# Altium schematic sheet PA_Receiver.SchDoc
size A3; SheetNumber: 1; SheetTotal: 1
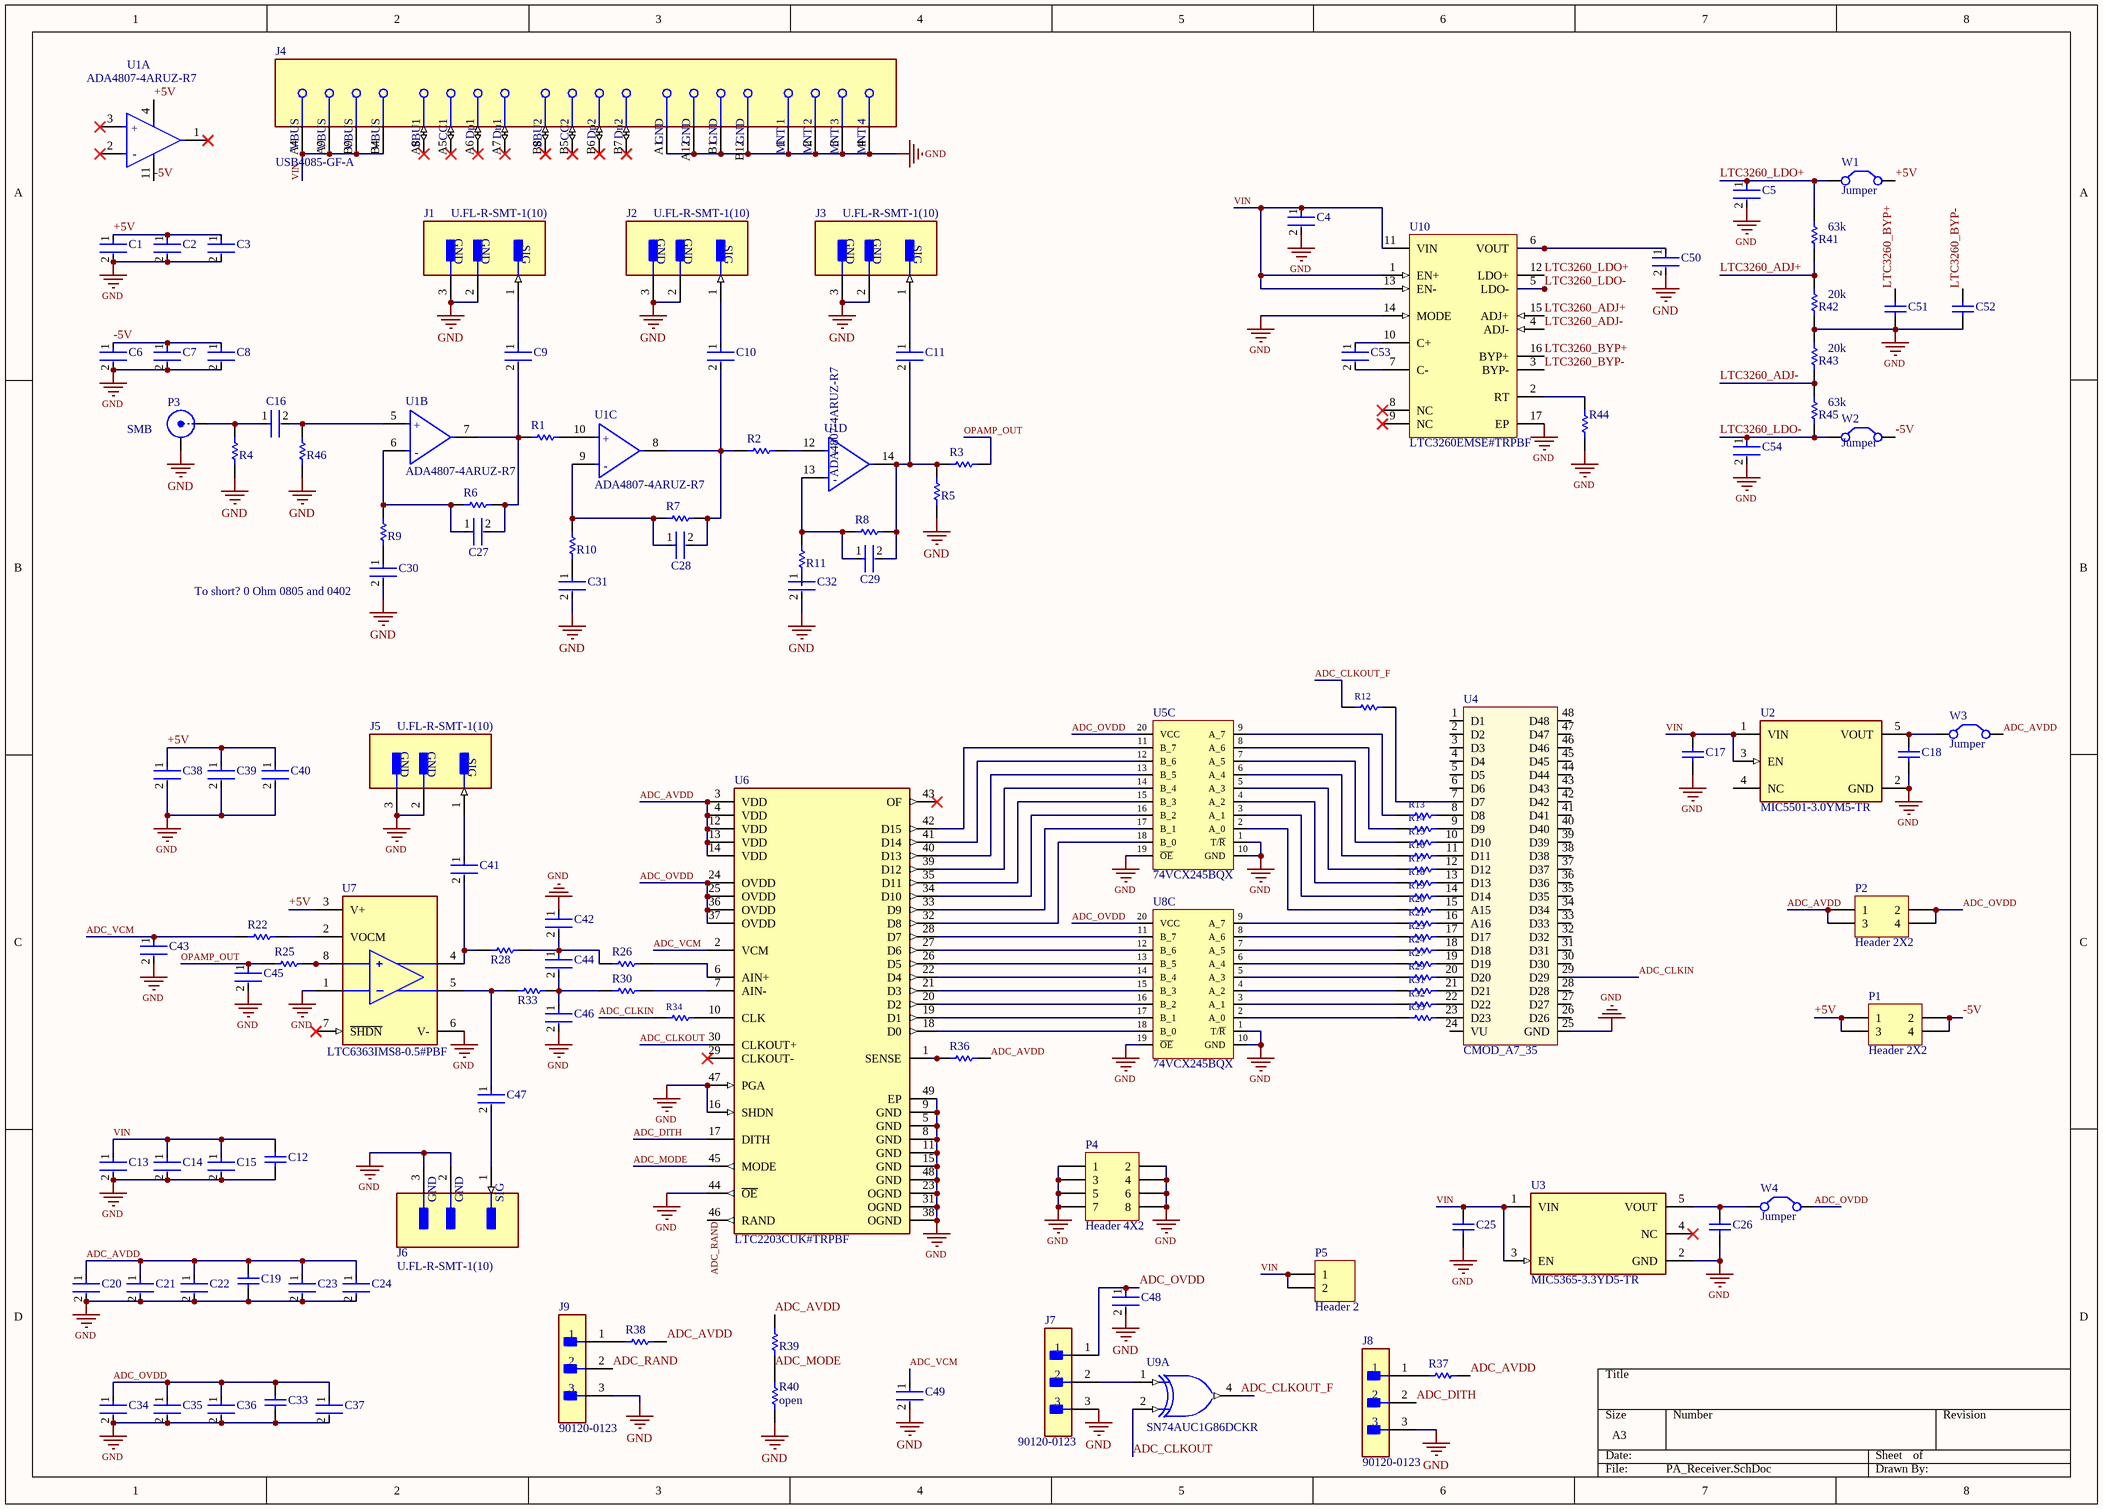
[diagram p0: PA_Receiver.SchDoc]

## Parts
C1  CL21B106KOQNNNG  [FP-CL21B106KOQNNNG-MFG]  (value not drawn)
C2  GRM21BR71C475KE51K  [FP-GRM21B-0_15-MFG]  (value not drawn)
C3  C0805C104K5RACTU  [FP-C0805C-DN-MFG]  (value not drawn)
C4  CL21B106KOQNNNG  [FP-CL21B106KOQNNNG-MFG]  (value not drawn)
C5  CL21B106KOQNNNG  [FP-CL21B106KOQNNNG-MFG]  (value not drawn)
C6  CL21B106KOQNNNG  [FP-CL21B106KOQNNNG-MFG]  (value not drawn)
C7  GRM21BR71C475KE51K  [FP-GRM21B-0_15-MFG]  (value not drawn)
C8  C0805C104K5RACTU  [FP-C0805C-DN-MFG]  (value not drawn)
C9  C0805C102K5RACTU  [FP-C0805C-DN-MFG]  (value not drawn)
C10  C0805C102K5RACTU  [FP-C0805C-DN-MFG]  (value not drawn)
C11  C0805C102K5RACTU  [FP-C0805C-DN-MFG]  (value not drawn)
C12  C0805C105K3RACTU  [CAPC2013X140X50LL20T25]  (value not drawn)
C13  CL21B106KOQNNNG  [FP-CL21B106KOQNNNG-MFG]  (value not drawn)
C14  GRM21BR71C475KE51K  [FP-GRM21B-0_15-MFG]  (value not drawn)
C15  C0805C104K5RACTU  [FP-C0805C-DN-MFG]  (value not drawn)
C16  CL21B222JBANNNC  [FP-CL21-IPC_B]  (value not drawn)
C17  C0805C105K3RACTU  [CAPC2013X140X50LL20T25]  (value not drawn)
C18  C0805C105K3RACTU  [CAPC2013X140X50LL20T25]  (value not drawn)
C19  C0805C105K3RACTU  [CAPC2013X140X50LL20T25]  (value not drawn)
C20  CL21B106KOQNNNG  [FP-CL21B106KOQNNNG-MFG]  (value not drawn)
C21  GRM21BR71C475KE51K  [FP-GRM21B-0_15-MFG]  (value not drawn)
C22  C0805C104K5RACTU  [FP-C0805C-DN-MFG]  (value not drawn)
C23  C0805C104K5RACTU  [FP-C0805C-DN-MFG]  (value not drawn)
C24  C0805C104K5RACTU  [FP-C0805C-DN-MFG]  (value not drawn)
C25  C0805C105K3RACTU  [CAPC2013X140X50LL20T25]  (value not drawn)
C26  C0805C105K3RACTU  [CAPC2013X140X50LL20T25]  (value not drawn)
C27  C0805C150K5RACTU  [FP-C0805C-DN-MFG]  (value not drawn)
C28  C0805C150K5RACTU  [FP-C0805C-DN-MFG]  (value not drawn)
C29  C0805C150K5RACTU  [FP-C0805C-DN-MFG]  (value not drawn)
C30  CL21B106KOQNNNG  [FP-CL21B106KOQNNNG-MFG]  (value not drawn)
C31  CL21B106KOQNNNG  [FP-CL21B106KOQNNNG-MFG]  (value not drawn)
C32  CL21B106KOQNNNG  [FP-CL21B106KOQNNNG-MFG]  (value not drawn)
C33  C0805C105K3RACTU  [CAPC2013X140X50LL20T25]  (value not drawn)
C34  CL21B106KOQNNNG  [FP-CL21B106KOQNNNG-MFG]  (value not drawn)
C35  GRM21BR71C475KE51K  [FP-GRM21B-0_15-MFG]  (value not drawn)
C36  C0805C104K5RACTU  [FP-C0805C-DN-MFG]  (value not drawn)
C37  C0805C104K5RACTU  [FP-C0805C-DN-MFG]  (value not drawn)
C38  CL21B106KOQNNNG  [FP-CL21B106KOQNNNG-MFG]  (value not drawn)
C39  GRM21BR71C475KE51K  [FP-GRM21B-0_15-MFG]  (value not drawn)
C40  C0805C104K5RACTU  [FP-C0805C-DN-MFG]  (value not drawn)
C41  C0805C102K5RACTU  [FP-C0805C-DN-MFG]  (value not drawn)
C42  C0805C100J5RACTU  [FP-C0805C-DN-MFG]  (value not drawn)
C43  C0805C104K5RACTU  [FP-C0805C-DN-MFG]  (value not drawn)
C44  C0805C100J5RACTU  [FP-C0805C-DN-MFG]  (value not drawn)
C45  C0805C100J5RACTU  [FP-C0805C-DN-MFG]  (value not drawn)
C46  C0805C100J5RACTU  [FP-C0805C-DN-MFG]  (value not drawn)
C47  C0805C102K5RACTU  [FP-C0805C-DN-MFG]  (value not drawn)
C48  C0805C104K5RACTU  [FP-C0805C-DN-MFG]  (value not drawn)
C49  C2012X7R1C225K125AB  [FP-C2012-125-0_2-MFG]  (value not drawn)
C50  CL21B106KOQNNNG  [FP-CL21B106KOQNNNG-MFG]  (value not drawn)
C51  C0805F103K5RACTU  [CAPC2013X100X50NL20T25]  (value not drawn)
C52  C0805F103K5RACTU  [CAPC2013X100X50NL20T25]  (value not drawn)
C53  CL21B105KAFNNNG  [FP-CL21-IPC_C]  (value not drawn)
C54  CL21B106KOQNNNG  [FP-CL21B106KOQNNNG-MFG]  (value not drawn)
J1  U.FL-R-SMT-1(10)  [FP-U_FL-R-SMT-1_10-MFG]
J2  U.FL-R-SMT-1(10)  [FP-U_FL-R-SMT-1_10-MFG]
J3  U.FL-R-SMT-1(10)  [FP-U_FL-R-SMT-1_10-MFG]
J4  USB4085-GF-A  [FP-USB4085-GF-A-MFG]
J5  U.FL-R-SMT-1(10)  [FP-U_FL-R-SMT-1_10-MFG]
J6  U.FL-R-SMT-1(10)  [FP-U_FL-R-SMT-1_10-MFG]
J7  90120-0123  [FP-90120-0123-MFG]
J8  90120-0123  [FP-90120-0123-MFG]
J9  90120-0123  [FP-90120-0123-MFG]
P1  Header 2X2  [HDR2X2]
P2  Header 2X2  [HDR2X2]
P3  SMB  [SMB_V-RJ45]
P4  Header 4X2  [HDR2X4]
P5  Header 2  [HDR1X2]
R1  RC0805FR-071KL  [RESC2013X60X35ML10T20]  (value not drawn)
R2  RC0805FR-071KL  [RESC2013X60X35ML10T20]  (value not drawn)
R3  ERJ-6GEY0R00V  [RESC2013X70X40NL20T20]  (value not drawn)
R4  RK73B2ATTD510J  [RESC2013X60X30ML20T20]  (value not drawn)
R5  RK73B2ATTD510J  [RESC2013X60X30ML20T20]  (value not drawn)
R6  RC0805FR-071KL  [RESC2013X60X35ML10T20]  (value not drawn)
R7  RC0805FR-071KL  [RESC2013X60X35ML10T20]  (value not drawn)
R8  RC0805FR-071KL  [RESC2013X60X35ML10T20]  (value not drawn)
R9  RC0805FR-07100RL  [RESC2013X60X35ML10T20]  (value not drawn)
R10  RC0805FR-07100RL  [RESC2013X60X35ML10T20]  (value not drawn)
R11  RC0805FR-07100RL  [RESC2013X60X35ML10T20]  (value not drawn)
R12  RC0805FR-0733RL  [RESC2013X60X35LL10T20]  (value not drawn)
R13  RC0805FR-0733RL  [RESC2013X60X35LL10T20]  (value not drawn)
R14  RC0805FR-0733RL  [RESC2013X60X35LL10T20]  (value not drawn)
R15  RC0805FR-0733RL  [RESC2013X60X35LL10T20]  (value not drawn)
R16  RC0805FR-0733RL  [RESC2013X60X35LL10T20]  (value not drawn)
R17  RC0805FR-0733RL  [RESC2013X60X35LL10T20]  (value not drawn)
R18  RC0805FR-0733RL  [RESC2013X60X35LL10T20]  (value not drawn)
R19  RC0805FR-0733RL  [RESC2013X60X35LL10T20]  (value not drawn)
R20  RC0805FR-0733RL  [RESC2013X60X35LL10T20]  (value not drawn)
R21  RC0805FR-0733RL  [RESC2013X60X35LL10T20]  (value not drawn)
R22  RC0805FR-07100RL  [RESC2013X60X35ML10T20]  (value not drawn)
R23  RC0805FR-0733RL  [RESC2013X60X35LL10T20]  (value not drawn)
R24  RC0805FR-0733RL  [RESC2013X60X35LL10T20]  (value not drawn)
R25  ERJ-6GEY0R00V  [RESC2013X70X40NL20T20]  (value not drawn)
R26  RC0805JR-075R1L  [RESC2013X60X35LL10T20]  (value not drawn)
R27  RC0805FR-0733RL  [RESC2013X60X35LL10T20]  (value not drawn)
R28  RK73B2ATTD510J  [RESC2013X60X30ML20T20]  (value not drawn)
R29  RC0805FR-0733RL  [RESC2013X60X35LL10T20]  (value not drawn)
R30  RC0805JR-075R1L  [RESC2013X60X35LL10T20]  (value not drawn)
R31  RC0805FR-0733RL  [RESC2013X60X35LL10T20]  (value not drawn)
R32  RC0805FR-0733RL  [RESC2013X60X35LL10T20]  (value not drawn)
R33  RK73B2ATTD510J  [RESC2013X60X30ML20T20]  (value not drawn)
R34  RC0805FR-0733RL  [RESC2013X60X35LL10T20]  (value not drawn)
R35  RC0805FR-0733RL  [RESC2013X60X35LL10T20]  (value not drawn)
R36  RK73H2ATTD10R0F  [RESC2013X60X30ML20T20]  (value not drawn)
R37  RK73H2ATTD1002F  [RESC2013X60X30LL20T20]  (value not drawn)
R38  RK73H2ATTD1002F  [RESC2013X60X30LL20T20]  (value not drawn)
R39  RC0805FR-071KL  [RESC2013X60X35ML10T20]  (value not drawn)
R40  value open  [RESC2013X60X35LL10T20]  (hidden comment: Resistor)
R41  63k  [RESC2013X60X30ML20T20]
R42  20k  [RESC2013X60X30ML20T20]
R43  20k  [RESC2013X60X30ML20T20]
R44  CRCW0805200KFKEA  [RESC2013X50X30NL20T20]  (value not drawn)
R45  63k  [RESC2013X60X30ML20T20]
R46  RK73B2ATTD510J  [RESC2013X60X30ML20T20]  (value not drawn)
U1  ADA4807-4ARUZ-R7  [FP-RU-14-IPC_B]  (parts A,B,C,D of 4)
U2  MIC5501-3.0YM5-TR  [FP-SOT23-5LD-PL-1-MFG]
U3  MIC5365-3.3YD5-TR  [FP-TSOT-5LD-PL-1-IPC_C]
U4  CMOD_A7_35  [PCBComponent_1]
U5  74VCX245BQX  [QFN21P50_450X250X80L40X24T305X105N]  (part C of 3)
U6  LTC2203CUK#TRPBF  [FP-UK-48-05-08-1704-IPC_C]
U7  LTC6363IMS8-0.5#PBF  [FP-MS8-8-05-08-1660-IPC_A]
U8  74VCX245BQX  [QFN21P50_450X250X80L40X24T305X105N]  (part C of 3)
U9  SN74AUC1G86DCKR  [DCK0005A_N]  (part A of 2)
U10  LTC3260EMSE#TRPBF  [LT-MSE-16-EDP_L]
W1  Jumper  [FP-M20-9990246-MFG]
W2  Jumper  [FP-M20-9990246-MFG]
W3  Jumper  [FP-M20-9990246-MFG]
W4  Jumper  [FP-M20-9990246-MFG]

## Nets
GND: C1.2 C2.2 C3.2 C4.2 C5.2 C6.2 C7.2 C8.2 C12.1 C13.2 C14.2 C15.2 C17.1 C18.1 C19.1 C20.2 C21.2 C22.2 C23.2 C24.2 C25.1 C26.1 C30.2 C31.2 C32.2 C33.1 C34.2 C35.2 C36.2 C37.2 C38.2 C39.2 C40.2 C42.1 C43.2 C45.2 C46.2 C48.2 C49.2 C50.2 C51.1 C52.1 C54.2 J1.2(GND) J1.3(GND) J2.2(GND) J2.3(GND) J3.2(GND) J3.3(GND) J4.1(MNT_1) J4.2(MNT_2) J4.3(MNT_3) J4.4(MNT_4) J4.A1(GND) J4.A12(GND) J4.B1(GND) J4.B12(GND) J5.2(GND) J5.3(GND) J6.2(GND) J6.3(GND) J7.3 J8.3 J9.3 P3.2(Y) P4.1 P4.2 P4.3 P4.4 P4.5 P4.6 P4.7 P4.8 R4.1 R5.1 R40.1 R42.1 R43.2 R44.1 R46.1 U2.2(GND) U3.2(GND) U4.25(GND) U5.1(T/~{R}) U5.10(GND) U5.19(~{OE}) U6.5(GND) U6.8(GND) U6.9(GND) U6.11(GND) U6.15(GND) U6.16(SHDN) U6.23(OGND) U6.31(OGND) U6.38(OGND) U6.44(~{OE}) U6.47(PGA) U6.48(GND) U6.49(EP) U7.1(-IN) U7.6(V-) U8.1(T/~{R}) U8.10(GND) U8.19(~{OE}) U10.14(MODE) U10.17(EP)
+5V: C1.1 C2.1 C3.1 C38.1 C39.1 C40.1 P1.1 P1.3 U1.4(+VS) U7.3(V+) W1.2(C2)
-5V: C6.1 C7.1 C8.1 P1.2 P1.4 U1.11(-VS) W2.2(C2)
ADC_AVDD: C19.2 C20.1 C21.1 C22.1 C23.1 C24.1 P2.1 P2.3 R36.2 R37.2 R38.2 R39.2 U6.3(VDD) U6.4(VDD) U6.12(VDD) U6.13(VDD) U6.14(VDD) W3.2(C2)
ADC_CLKIN: R34.1 U4.29(D29)
ADC_CLKOUT: U6.30(CLKOUT+) U9.2(B)
ADC_CLKOUT_F: R12.1 U9.4(Y)
ADC_DITH: J8.2 U6.17(DITH)
ADC_MODE: R39.1 R40.2 U6.45(MODE)
ADC_OVDD: C33.2 C34.1 C35.1 C36.1 C37.1 C48.1 J7.1 P2.2 P2.4 U5.20(VCC) U6.24(OVDD) U6.25(OVDD) U6.36(OVDD) U6.37(OVDD) U8.20(VCC) W4.2(C2)
ADC_RAND: J9.2 U6.46(RAND)
ADC_VCM: C43.1 C49.1 R22.1 U6.2(VCM)
LTC3260_ADJ+: R41.1 R42.2 U10.15(ADJ+)
LTC3260_ADJ-: R43.1 R45.2 U10.4(ADJ-)
LTC3260_BYP+: C51.2 U10.16(BYP+)
LTC3260_BYP-: C52.2 U10.3(BYP-)
LTC3260_LDO+: C5.1 R41.2 U10.12(LDO+) W1.1(C1)
LTC3260_LDO-: C54.1 R45.1 U10.5(LDO-) W2.1(C1)
OPAMP_OUT: C45.1 R3.2 R25.1
VIN: C4.1 C12.2 C13.1 C14.1 C15.1 C17.2 C25.2 J4.A4(VBUS) J4.A9(VBUS) J4.B4(VBUS) J4.B9(VBUS) P5.1 P5.2 U2.1(VIN) U2.3(EN) U3.1(VIN) U3.3(EN) U10.1(EN+) U10.11(VIN) U10.13(EN-)
NetC9_1: C9.1 J1.1(SIG)
NetC9_2: C9.2 C27.2 R1.1 R6.2 U1.7(VOUT2)
NetC10_1: C10.1 J2.1(SIG)
NetC10_2: C10.2 C28.2 R2.1 R7.2 U1.8(VOUT3)
NetC11_1: C11.1 J3.1(SIG)
NetC11_2: C11.2 C29.2 R3.1 R5.2 R8.2 U1.14(VOUT4)
NetC16_1: C16.1 P3.1(X) R4.2
NetC16_2: C16.2 R46.2 U1.5(+IN2)
NetC18_2: C18.2 U2.5(VOUT) W3.1(C1)
NetC26_2: C26.2 U3.5(VOUT) W4.1(C1)
NetC27_1: C27.1 R6.1 R9.1 U1.6(-IN2)
NetC28_1: C28.1 R7.1 R10.1 U1.9(-IN3)
NetC29_1: C29.1 R8.1 R11.1 U1.13(-IN4)
NetC30_1: C30.1 R9.2
NetC31_1: C31.1 R10.2
NetC32_1: C32.1 R11.2
NetC41_1: C41.1 J5.1(SIG)
NetC41_2: C41.2 R28.2 U7.4(+OUT)
NetC42_2: C42.2 C44.1 R26.1 R28.1
NetC44_2: C44.2 C46.1 R30.1 R33.1
NetC47_1: C47.1 R33.2 U7.5(-OUT)
NetC47_2: C47.2 J6.1(SIG)
NetC50_1: C50.1 U10.6(VOUT)
NetC53_1: C53.1 U10.10(C+)
NetC53_2: C53.2 U10.7(C-)
NetJ7_2: J7.2 U9.1(A)
NetJ8_1: J8.1 R37.1
NetJ9_1: J9.1 R38.1
NetR1_2: R1.2 U1.10(+IN3)
NetR2_2: R2.2 U1.12(+IN4)
NetR12_2: R12.2 U4.7(D7)
NetR13_1: R13.1 U5.9(A_7)
NetR13_2: R13.2 U4.8(D8)
NetR14_1: R14.1 U5.8(A_6)
NetR14_2: R14.2 U4.9(D9)
NetR15_1: R15.1 U5.7(A_5)
NetR15_2: R15.2 U4.10(D10)
NetR16_1: R16.1 U5.6(A_4)
NetR16_2: R16.2 U4.11(D11)
NetR17_1: R17.1 U5.5(A_3)
NetR17_2: R17.2 U4.12(D12)
NetR18_1: R18.1 U5.4(A_2)
NetR18_2: R18.2 U4.13(D13)
NetR19_1: R19.1 U5.3(A_1)
NetR19_2: R19.2 U4.14(D14)
NetR20_1: R20.1 U5.2(A_0)
NetR20_2: R20.2 U4.15(A15)
NetR21_1: R21.1 U8.9(A_7)
NetR21_2: R21.2 U4.16(A16)
NetR22_2: R22.2 U7.2(VOCM)
NetR23_1: R23.1 U8.8(A_6)
NetR23_2: R23.2 U4.17(D17)
NetR24_1: R24.1 U8.7(A_5)
NetR24_2: R24.2 U4.18(D18)
NetR25_2: R25.2 U7.8(+IN)
NetR26_2: R26.2 U6.6(AIN+)
NetR27_1: R27.1 U8.6(A_4)
NetR27_2: R27.2 U4.19(D19)
NetR29_1: R29.1 U8.5(A_3)
NetR29_2: R29.2 U4.20(D20)
NetR30_2: R30.2 U6.7(AIN-)
NetR31_1: R31.1 U8.4(A_2)
NetR31_2: R31.2 U4.21(D21)
NetR32_1: R32.1 U8.3(A_1)
NetR32_2: R32.2 U4.22(D22)
NetR34_2: R34.2 U6.10(CLK)
NetR35_1: R35.1 U8.2(A_0)
NetR35_2: R35.2 U4.23(D23)
NetR36_1: R36.1 U6.1(SENSE)
NetR44_2: R44.2 U10.2(RT)
NetU5_11: U5.11(B_7) U6.42(D15)
NetU5_12: U5.12(B_6) U6.41(D14)
NetU5_13: U5.13(B_5) U6.40(D13)
NetU5_14: U5.14(B_4) U6.39(D12)
NetU5_15: U5.15(B_3) U6.35(D11)
NetU5_16: U5.16(B_2) U6.34(D10)
NetU5_17: U5.17(B_1) U6.33(D9)
NetU5_18: U5.18(B_0) U6.32(D8)
NetU6_18: U6.18(D0) U8.18(B_0)
NetU6_19: U6.19(D1) U8.17(B_1)
NetU6_20: U6.20(D2) U8.16(B_2)
NetU6_21: U6.21(D3) U8.15(B_3)
NetU6_22: U6.22(D4) U8.14(B_4)
NetU6_26: U6.26(D5) U8.13(B_5)
NetU6_27: U6.27(D6) U8.12(B_6)
NetU6_28: U6.28(D7) U8.11(B_7)

Not connected (* = marked no-connect by the designer): J4 A5(CC1)* A6(Dp1)* A7(Dn1)* A8(SBU1)* B5(CC2)* B6(Dp2)* B7(Dn2)* B8(SBU2)*; U1 1(VOUT1)* 2(-IN1)* 3(+IN1)*; U2 4(NC); U3 4(NC)*; U4 1(D1) 2(D2) 3(D3) 4(D4) 5(D5) 6(D6) 24(VU) 26(D26) 27(D27) 28(D28) 30(D30) 31(D31) 32(D32) 33(D33) 34(D34) 35(D35) 36(D36) 37(D37) 38(D38) 39(D39) 40(D40) 41(D41) 42(D42) 43(D43) 44(D44) 45(D45) 46(D46) 47(D47) 48(D48); U6 29(CLKOUT-)* 43(OF)*; U7 7(~{SHDN})*; U10 8(NC)* 9(NC)*

## Notes on the sheet
- (near C30) To short? 0 Ohm 0805 and 0402
- (in symbol CMP-09116-000192-1, part A) +; -
- (in symbol CMP-09116-000192-1, part B) +; -
- (in symbol CMP-09116-000192-1, part C) +; -
- (in symbol CMP-09116-000192-1, part D) +; -

## Library data of the parts
C1 C4-C6 C13 C20 C30-C32 C34 C38 C50 C54 = CMP-13271-000015-1: CAP CER 10UF 16V X7R 0805; Manufacturer: Samsung Electro-Mechanics; Temperature Coefficient: 15%; Tolerance: 10%; Material: Ceramic; ComponentLink2URL: http://product.samsungsem.com/mlcc/CL21B106KOQNNN.do; Package: 0; Voltage Rating: 16V; Value: 10uF; Height: 1.4mm; Temperature Characteristic: X7R; Manufacturer Part Number: CL21B106KOQNNNG; Category: Cap; Lead Free: Yes; RoHS: TRUE; ComponentLink2Description: Datasheet; Octopart: https://octopart.com/cl21b106koqnnng-samsung-19995691; Device Class L1: Passive Components; Temperature Range Low: -55°C; Device Class L3: Ceramic Capacitors; Ipc Land Pattern Name: CAPC200125X125; Digikey Description: CAP CER 10UF 16V X7R 0805; Automotive: No; Capacitance: 10uF; Temperature Range High: +125°C; Device Class L2: Capacitors; Temperature: -55°C to +125°C
C2 C7 C14 C21 C35 C39 = CMP-06035-031349-1: Chip Multilayer Ceramic Capacitors for General Purpose, 0805, 4.7uF, X7R, 15%, 10%, 16V; Dielectric: X7R; Length: 2mm; Tolerance: 10%; Capacitance: 4.7uF; Voltage Rating (DC): 16V; Width: 1.25mm; Thickness: 1.25mm; Case/Package: 0805
C3 C8 C15 C22-C24 C36 C37 C40 C43 C48 = CMP-2007-00279-2: CAP CER 0.1UF 50V X7R 0805; Manufacturer: KEMET; Value: 0.10 μF; Tolerance: 0.1; Temperature Coefficient: 30ppm/°C; Material: Ceramic; Manufacturer Part Number: C0805C104K5RACTU; Device Class L2: Capacitors; Temperature Range Low: -55°C; Voltage Rating: 50 V; Digikey Description: CAP CER 0.1UF 50V X7R 0805; Category: Cap; ComponentLink2Description: Datasheet; Octopart: https://octopart.com/c0805c104k5ractu-kemet-143926; RoHS: TRUE; ComponentLink2URL: https://content.kemet.com/datasheets/KEM_C1003_C0G_SMD.pdf; Temperature Characteristic: X7R; Temperature: -55°C to +125°C; Height: 0.88mm; Temperature Range High: +125°C; Device Class L1: Passive Components; Automotive: No; Lead Free: Yes; Ipc Land Pattern Name: CAPC200125X78; Device Class L3: Ceramic Capacitors; Mouser Description: Cap Ceramic 0.1uF 50V X7R 10% SMD 2.0 x 1.2 mm 125 C Paper T/R; Capacitance: 0.10 μF; Package: C0805C-DN
C9-C11 C41 C47 = CMP-2007-01097-2: CAP CER 1000PF 50V X7R 0805; Manufacturer: KEMET; Capacitance: 1,000 pF; Value: 1,000 pF; Tolerance: 0.1; Temperature Coefficient: 30ppm/°C; Material: Ceramic; Temperature Range High: +125°C; Automotive: No; Device Class L3: Ceramic Capacitors; Category: Cap; Height: 0.88mm; Ipc Land Pattern Name: CAPC200125X78; Mouser Description: Cap Ceramic 0.001uF 50V X7R 10% SMD 0805 125C Plastic T/R; Device Class L1: Passive Components; Lead Free: Yes; Temperature Range Low: -55°C; ComponentLink2URL: https://content.kemet.com/datasheets/KEM_C1003_C0G_SMD.pdf; Octopart: https://octopart.com/c0805c102k5ractu-kemet-93010; Temperature: -55°C to +125°C; Package: C0805C-DN; RoHS: TRUE; Voltage Rating: 50 V; ComponentLink2Description: Datasheet; Digikey Description: CAP CER 1000PF 50V X7R 0805; Device Class L2: Capacitors; Manufacturer Part Number: C0805C102K5RACTU; Temperature Characteristic: X7R
C12 C17-C19 C25 C26 C33 = CMP-2007-03234-1: Manufacturer: Kemet; Part Number: C0805C105K3RACTU
C16 = CMP-13271-000077-1: CL21 Series 0805 2.2nF 50V ±5% Tolerance X7R Multilayer Ceramic Chip Capacitor; Voltage Rating: 50V; Case/Package: 0805; Voltage Rating (DC): 50V; Dielectric: X7R; Lead Free: Lead Free; Max Operating Temperature: 125°C; Width: 0.049inch; Case Code (Imperial): 0805; Case Code (Metric): 2012; Tolerance: 5%; Length: 2mm; Mount: Surface Mount; Contact Plating: Tin; Voltage: 50V; Height: 0.65mm; Package Quantity: 4000; Thickness: 0.03inch; Depth: 1.25mm; Min Operating Temperature: -55°C; Radiation Hardening: No; Capacitance: 2.2nF; Packaging: Tape and Reel
C27-C29 = CMP-03020-023493-1: CAP CER SMD 0805 15PF 50V 10% X7; Manufacturer: KEMET; Temperature Characteristic: X7R; Tolerance: 0.1; Material: Ceramic; Temperature Coefficient: 30ppm/°C; Octopart: https://octopart.com/c0805c150k5ractu-kemet-88373275; ComponentLink2URL: https://content.kemet.com/datasheets/KEM_C1003_C0G_SMD.pdf; Manufacturer Part Number: C0805C150K5RACTU; Device Class L3: Ceramic Capacitors; Lead Free: Yes; Digikey Description: CAP CER SMD 0805 15PF 50V 10% X7; Value: 15 pF; Mouser Description: Cap Ceramic 15pF 50V X7R 10% SMD 0805 125°C Paper T/R; Automotive: No; Voltage Rating: 50 V; Ipc Land Pattern Name: CAPC200125X78; Height: 0.88mm; Device Class L2: Capacitors; Capacitance: 15 pF; Temperature: -55°C to +125°C; Category: Cap; RoHS: TRUE; Temperature Range High: +125°C; Temperature Range Low: -55°C; Device Class L1: Passive Components; Package: C0805C-DN; ComponentLink2Description: Datasheet
C42 C44-C46 = CMP-03020-021676-1: C0805 10 pF X7R 30ppm/°C 5.00% 50 V; Manufacturer: KEMET; Material: Ceramic; Value: 10 pF; Voltage Rating: 50 V; Tolerance: 0.05; ComponentLink2URL: https://content.kemet.com/datasheets/KEM_C1003_C0G_SMD.pdf; Device Class L2: Capacitors; Octopart: https://octopart.com/c0805c100j5ractu-kemet-81794931; Height: 0.88mm; Ipc Land Pattern Name: CAPC200125X78; ComponentLink2Description: Datasheet; Temperature Range Low: -55°C; Automotive: No; Category: Cap; Device Class L3: Ceramic Capacitors; Device Class L1: Passive Components; Capacitance: 10 pF; Manufacturer Part Number: C0805C100J5RACTU; Temperature Coefficient: 30ppm/°C; Temperature Range High: +125°C; Lead Free: Yes; Package: C0805C-DN; Temperature: -55°C to +125°C; Mouser Description: Cap, 10PF, 50V, Mlcc, 0805; RoHS: TRUE; Temperature Characteristic: X7R
C49 = CMP-08246-006241-1: Multilayer Ceramic Capacitors 2.2μF ±10% 16V X7R SMD 0805; Capacitance: 2.2uF; Radiation Hardening: No; Series: C; REACH SVHC: No SVHC; Max Operating Temperature: 125°C; Case Code (Metric): 2012; Construction: Flat; Lead Free: Lead Free; Number of Pins: 2; Voltage Rating: 16V; Min Operating Temperature: -55°C; Voltage Rating (DC): 16V; Package Quantity: 2000; Thickness: 0.057inch; Case Code (Imperial): 0805; RoHS Compliant: Yes; Length: 2mm; Depth: 1.25mm; Packaging: Tape and Reel; Tolerance: 10%; Mount: Surface Mount; Dielectric: X7R; Width: 1.25mm; Case/Package: 0805; Weight: 0.000194oz; Dielectric Material: Ceramic; Termination: SMD/SMT; Voltage: 16V; Resistor Type: Ceramic; Height: 1.25mm
C51 C52 = CMP-2007-03708-1: Manufacturer: Kemet; Part Number: C0805F103K5RACTU
C53 = CMP-13271-003813-1: CL21 Series 0805 1uF 25V ±10% Tolerance X7R Multilayer Ceramic Chip Capacitor; Case Code (Imperial): 0805; Length: 2mm; Max Operating Temperature: 125°C; Tolerance: 10%; Depth: 1.25mm; Package Quantity: 3000; Material: Ceramic; Voltage Rating: 25V; Capacitance: 1uF; Height: 1.25mm; Mount: Surface Mount; Dielectric: X7R; Packaging: Tape and Reel; Voltage: 25V; Case/Package: 0805; Radiation Hardening: No; Thickness: 0.053inch; Width: 0.049inch; Min Operating Temperature: -55°C; Case Code (Metric): 2012
J1-J3 J5 J6 = CMP-2000-05152-3: CONN U.FL RCPT STR 50 OHM SMD; Max Frequency: 6GHz; Connector Type: Coaxial; Body Plating: Silver; Body Material: Bronze; Impedance: 50R; Dielectric Material: Polymer; Insulation Resistance: 500MR; Gender: Male; Packaging: Cut Tape; Length: 3mm; Package Quantity: 2500; Termination: Solder; Lead Free: Lead Free; Series: U.FL; Min Operating Temperature: -40°C; Fastening Type: Snap; Contact Material: Brass; Orientation: Straight; Wire/Cable Type: Coaxial; Frequency: 6GHz; Contact Plating: Gold; Depth: 3.1mm; Weight: 0.001764oz; Max Operating Temperature: 90°C; Radiation Hardening: No; REACH SVHC: No SVHC; Mount: Surface Mount; Housing Color: Beige
J4 = CMP-196119-000001-2: CONN RCPT USB2.0 TYPE C 24POS RA; Gender: Receptacle; Number of Positions: 16; USB Standard: USB 2.0; Orientation: Right Angle; Contact Plating: Gold; Contact Material: Copper Alloy
J7-J9 = CMP-04776-000237-1: CONN HEADER VERT 3POS 2.54MM; Number of Circuits: 3; Max Voltage Rating (DC): 350.35kV; Contact Resistance: 20mR; Gender: Male; Voltage Rating (AC): 350V; Glow Wire Compliant: Non-compliant; Current Rating: 3A; Contact Post Length: 2.9mm; Number of Contacts: 3; Number of Rows: 1; Max Operating Temperature: 125°C; Orientation: Vertical; Number of Positions: 3; Packaging: Tray; Contact Mating Length: 6.75mm; Housing Color: Black; Termination: Solder; Contact Material: Brass; Radiation Hardening: No; Lead Free: Lead Free; Pitch: 2.54mm; RoHS Compliant: Yes; Voltage Rating: 350V; Contact Plating: Tin; Color: Black; Min Operating Temperature: -55°C; Mount: Through Hole; Housing Material: Polyester; Series: 90120; Contact Gender: Male; REACH SVHC: No SVHC
P1 P2 = Header 2X2: Header, 2-Pin, Dual row; LatestRevisionDate: 17-Jul-2002; LatestRevisionNote: Re-released for DXP Platform.; Publisher: Altium Limited
P3 = SMB: SMB Straight Connector; LatestRevisionDate: 17-Jul-2002; LatestRevisionNote: Re-released for DXP Platform.; Publisher: Altium Limited
P4 = Header 4X2: Header, 4-Pin, Dual row; LatestRevisionDate: 17-Jul-2002; LatestRevisionNote: Re-released for DXP Platform.; Publisher: Altium Limited
P5 = Header 2: Header, 2-Pin; LatestRevisionDate: 17-Jul-2002; LatestRevisionNote: Re-released for DXP Platform.; Publisher: Altium Limited
R1 R2 R6-R8 R39 = CMP-2100-03671-1: Chip Resistor, 1 KOhm, +/- 1%, 125 mW, -55 to 155 degC, 0805 (2012 Metric), RoHS, Tape and Reel; Manufacturer: Yageo; Temperature Coefficient: 100ppm/degreesC; Voltage Rating (DC): 150V; Max Power Dissipation: 125mW; Resistance: 1KOhm; Number of Pins: 2; Number of Terminations: 2; Datasheet URL: http://www.yageo.com/NewPortal/yageodocoutput?fileName=/pdf/R-Chip/PYu-RC_Group_51_RoHS_L_5.pdf; Length: 0.079inch; Package Description: 2-Pin Surface Mounted Device, Body 2 x 1.25 mm; Depth: 1.25mm; Height: 0.024inch; Military Standard: Not; Case/Package: 0805; Package Reference: 0805; RoHSCompliant: true; Lead Free: LeadFree; Packaging: TapeandReel; Package Quantity: 1; Datasheet Version: Rev. 5, 10/2016; Tolerance: 1%; Min Operating Temperature: -55degC; Voltage Rating: 150V; Composition: ThickFilm; Case Code (Imperial): 0805; Power Rating: 125mW; Width: 0.049inch; Case Code (Metric): 2012; Manufacturer URL: http://www.yageo.com/; Max Operating Temperature: 155degC; REACH SVHC: Unknown; Termination: SMD/SMT
R3 R25 = CMP-1665-00002-5: Chip Resistor, 0 Ohm, +/- 1%, 0.125 W, -55 to 155 degC, 0805 (2012 Metric), RoHS, Tape and Reel; Tolerance: 5%; Resistance: 0 Ohm; REACH SVHC: No SVHC; Min Operating Temperature: -55 degC; Case/Package: 0805; Packaging: Tape and Reel; Package Quantity: 5000; ComponentLink1Description: Manufacturer URL; PackageDescription: 2-Pin Surface Mount Device, Body 2 x 1.25 mm; Mounting Technology: Surface Mount; Max Operating Temperature: 155 degC; PartNumber: ERJ-6GEY0R00V; Width: 1.25 mm; RoHSCompliant: True; Height: 0.6 mm; ComponentLink1URL: http://www.panasonic.com/; ComponentLink2URL: http://industrial.panasonic.com/cdbs/www-data/pdf/RDA0000/AOA0000C84.pdf; Case Code (Imperial): 0805; DatasheetVersion: 03/2015; Length: 2 mm; Case Code (Metric): 2012; ComponentLink2Description: Datasheet; Radiation Hardening: No
R4 R5 R28 R33 R46 = CMP-2001-01840-1: Manufacturer: KOA Speer; Part Number: RK73B2ATTD510J
R9-R11 R22 = CMP-2100-03669-1: Chip Resistor, 100 Ohm, +/-1%, 0.125 W, -55 to 155 degC, 0805 (2012 Metric), RoHS, Tape and Reel; Manufacturer: Yageo; Power Rating: 125mW; Resistance: 100Ohm; Voltage Rating: 150V; Tolerance: 1%; Temperature Coefficient: 100ppm/degreesC; Length: 2mm; Package Description: 2-Pin Surface Mounted Device, Body 2 x 1.25 mm; Case Code (Imperial): 0805; Number of Pins: 2; Termination: SMD/SMT; Lead Pitch: 0.4mm; Package Quantity: 1; Height: 0.024inch; Case Code (Metric): 2012; Number of Terminations: 2; Datasheet Version: Rev. 5, 10/2016; Lead Free: LeadFree; Package Reference: 0805; Composition: ThickFilm; REACH SVHC: Unknown; Voltage Rating (DC): 150V; Min Operating Temperature: -55degC; Packaging: TapeandReel; Military Standard: Not; Case/Package: 0805; Datasheet URL: http://www.yageo.com/NewPortal/yageodocoutput?fileName=/pdf/R-Chip/PYu-RC_Group_51_RoHS_L_5.pdf; Max Operating Temperature: 155degC; Manufacturer URL: http://www.yageo.com/; Max Power Dissipation: 125mW; Width: 0.049inch; Depth: 1.25mm; RoHSCompliant: true
R12-R21 R23 R24 R27 R29 R31 R32 R34 R35 = CMP-1659-00015-4: Chip Resistor, 33 Ohm, +/- 1%, 0.125 W, -55 to 155 degC, 0805 (2012 Metric), RoHS, Tape and Reel; Manufacturer: Yageo; Voltage Rating: 150 V; Max Operating Temperature: 155 degC; DatasheetVersion: Rev. 4, 02/2016; RoHSCompliant: true; ComponentLink2Description: Datasheet; PackageDescription: 2-Pin Surface Mounted Device, Body 2 x 1.25 mm; Package Quantity: 5000; Packaging: Tape and Reel; Min Operating Temperature: -55 degC; Mount: Surface Mount; REACH SVHC: No SVHC; ComponentLink1Description: Manufacturer URL; ComponentLink1URL: http://www.yageo.com/; Pins: 2; Mounting Technology: Surface Mount; Height: 0.5 mm; ComponentLink2URL: http://www.yageo.com/documents/recent/PYu-RC_Group_51_RoHS_L_04.pdf; PackageReference: 0805; Length: 2 mm
R26 R30 = CMP-2001-01391-1: Manufacturer: Yageo; Part Number: RC0805JR-075R1L
R36 = CMP-2001-02011-1: Manufacturer: KOA Speer; Part Number: RK73H2ATTD10R0F
R37 R38 = CMP-2001-01993-1: Manufacturer: KOA Speer; Part Number: RK73H2ATTD1002F
R40 = Resistor: TC1: 0; SimulationGenericComponent: True; TC2: 0
R41-R43 R45 = CMP-2001-01840-1: Part Number: RK73B2ATTD510J; Manufacturer: KOA Speer
R44 = CMP-2001-03660-1: Manufacturer: Vishay Dale; Part Number: CRCW0805200KFKEA
U1 = CMP-09116-000192-1: IC OPAMP VFB 4 CIRCUIT 14TSSOP; Min Supply Voltage: 2.7V; -3db Bandwidth: 180MHz; Power Supply Rejection Ratio (PSRR): 98dB; Operating Supply Current: 1mA; Gain Bandwidth Product: 170MHz; Number of Circuits: 4; Common Mode Rejection Ratio: 96dB; Output Current per Channel: 80mA; Slew Rate: 225V/µs; Input Bias Current: 1.2uA; Max Supply Voltage: 11V; Dual Supply Voltage: 5V; Voltage Gain: 130dB; Input Offset Voltage (Vos): 140uV; Packaging: Tape and Reel; Mount: Surface Mount; RoHS Compliant: Yes; Min Operating Temperature: -40°C; Case/Package: TSSOP; Max Operating Temperature: 125°C; Number of Pins: 14; Lead Free: Contains Lead
U2 = CMP-06324-000075-1: IC REG LINEAR 3V 300MA SOT23-5; Min Current Limit: 400mA; Dropout Voltage: 160mV; Number of Regulators: 1; Output Voltage: 3V; RoHS Compliant: Yes; Max Operating Temperature: 125°C; Packaging: Tape and Reel; Mount: Surface Mount; Output Current: 300mA; Min Operating Temperature: -40°C; Case/Package: SOT-23-5
U3 = CMP-06324-000114-1: IC REG LIN 3.3V 150MA TSOT23-5; Min Current Limit: 200mA; Min Input Voltage: 2.5V; Output Voltage Accuracy: 2%; Max Input Voltage: 5.5V; Output Configuration: Positive; Dropout Voltage: 155mV; Quiescent Current: 39uA; Power Supply Rejection Ratio (PSRR): 65dB; Output Type: Fixed; Number of Regulators: 1; Package Quantity: 1; Max Operating Temperature: 125°C; Min Output Voltage: 3.3V; Series: -; Packaging: Tape and Reel; RoHS Compliant: Yes; Number of Pins: 23; Polarity: Positive; Number of Outputs: 1; Output Current: 150mA; Case/Package: SOT-23-5; Output Voltage: 3.3V; Min Operating Temperature: -40°C; Mount: Surface Mount; Radiation Hardening: No
U5 U8 = 74VCX245BQX: IC TXRX NON-INVERT 3.6V 20-DQFN
U6 = CMP-09081-000363-1: IC ADC 16BIT PIPELINED 48QFN; Interface: Parallel; Sampling Rate: 25000000S/s; Max Power Dissipation: 264mW; Number of Converters: 1; Supply Type: Single; Number of Bits: 16; Case/Package: QFN; Min Operating Temperature: 0°C; Mount: Surface Mount; Package Quantity: 2000; RoHS Compliant: Yes; Max Operating Temperature: 75°C; Number of Pins: 48; Packaging: Tape and Reel
U7 = CMP-09116-000202-1: IC OPAMP DIFF 1 CIRCUIT 8MSOP; RoHS Compliant: Yes
U9 = CMP-0859-00373-3: Single 2-Input Exclusive-OR Gate, DCK0005A, LARGE T&R; Manufacturer: Texas Instruments; Bits(#): 1; Sub-Family: XOR Gate; Output Type: CMOS; ICC @ Nom Voltage(Max)(mA): 0.01; Output Drive (IOL/IOH)(Max)(mA): 9/-9; F @ Nom Voltage(Max)(Mhz): 250; 3-State Output: No; Gate Type: XOR; Technology Family: AUC; Logic: True; VCC(Min)(V): 0.8; VCC(Max)(V): 2.7; tpd @ Nom Voltage(Max)(ns): 5.5,3.8,2.6,1.7,1.3; Rating: Catalog; Voltage(Nom)(V): 0.8,1.2,1.5,1.8,2.5; Generic Part Number: SN74AUC1G86; Schmitt Trigger: No; DatasheetVersion: SCES389J; PackageReference: DCK0005A; Input Type: CMOS; Operating Temperature Range(C): -40 to 85
U10 = CMP-0475-00260-1: Low Noise Dual Supply Inverting Charge Pump, 4.5 to 32 V Vin, Adjustable Vout, 16-pin SOP (MSE-16-EDP), -40 to 125 degC, Pb-Free, Tape and Reel; Manufacturer: Linear Technology; Max Iout(mA): 100; Isupply(mA): 0.1; Ishutdown(uA): 2; Vin Min(V): 4.5; Frequency(kHz): 500; Vin Max(V): 32; Voutput: Adj; ComponentLink2URL: http://cds.linear.com/docs/en/datasheet/3260fa.pdf; PartNumber: LTC3260EMSE#TRPBF; PackageReference: MSE-16; Mounting Technology: Surface Mount; DatasheetVersion: Rev. A; ComponentLink3URL: http://cds.linear.com/docs/en/packaging/05081667_F_MSE16.pdf; ComponentLink1Description: Manufacturer URL; ComponentLink1URL: http://www.linear.com/; Packing: Tape and Reel; RoHS: TRUE; PackageDescription: 16-Pin Plastic MSOP, Exposed Die Pad, Body 4.039 x 3 mm, Pitch 0.5 mm; ComponentLink3Description: Package Specification; ComponentLink2Description: Datasheet; PackageVersion: Rev. F, 05/2013
W1-W4 = Jumper: Jumper Wire; Published: 24-Mar-1999; LatestRevisionDate: 17-Jul-2002; LatestRevisionNote: Re-released for DXP Platform.; PackageReference: RAD-0.2; Publisher: Altium Limited; PackageDescription: Radial Cap, Thru-Hole; 2 Leads; 0.2 in Pin Spacing